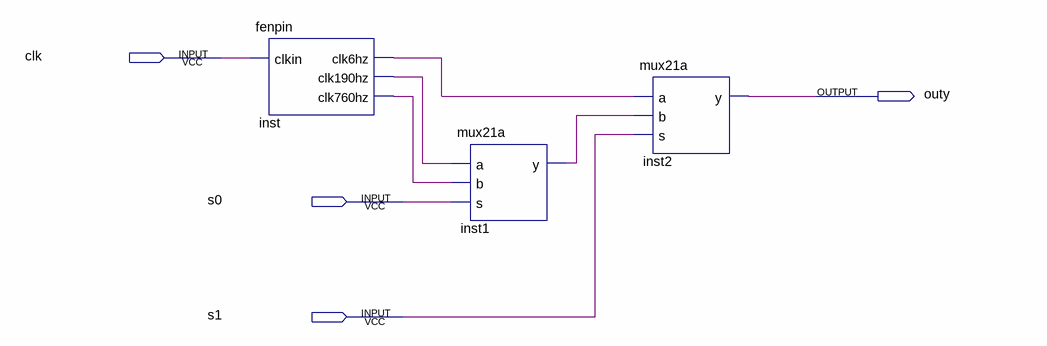
[diagram p0: schematic sheet]
// Quartus schematic muxk.bdf as structural Verilog: 3 symbols, 4 pins
module muxk (
  input  clk,
  input  s0,
  input  s1,
  output outy
);

  wire inst1_y, inst_clk6hz, inst_clk190hz, inst_clk760hz;

  fenpin inst (.clkin(clk), .clk6hz(inst_clk6hz), .clk190hz(inst_clk190hz), .clk760hz(inst_clk760hz));
  mux21a inst1 (.a(inst_clk190hz), .b(inst_clk760hz), .s(s0), .y(inst1_y));
  mux21a inst2 (.a(inst_clk6hz), .b(inst1_y), .s(s1), .y(outy));
endmodule
